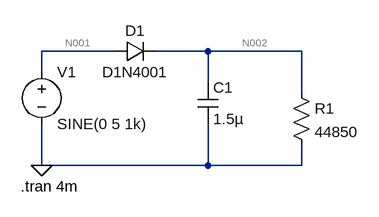
[diagram p0: schematic peak.asc]
peak.asc, the LTspice schematic file:
Version 4
SHEET 1 880 680
WIRE 128 144 16 144
WIRE 272 144 192 144
WIRE 416 144 272 144
WIRE 16 176 16 144
WIRE 272 192 272 144
WIRE 416 208 416 144
WIRE 16 320 16 256
WIRE 272 320 272 256
WIRE 272 320 16 320
WIRE 416 320 416 288
WIRE 416 320 272 320
FLAG 16 320 0
SYMBOL res 400 192 R0
SYMATTR InstName R1
SYMATTR Value 44850
SYMBOL diode 128 160 R270
WINDOW 0 32 32 VTop 2
WINDOW 3 0 32 VBottom 2
SYMATTR InstName D1
SYMATTR Value D1N4001
SYMBOL voltage 16 160 R0
WINDOW 123 0 0 Left 0
WINDOW 39 0 0 Left 0
SYMATTR InstName V1
SYMATTR Value SINE(0 5 1k)
SYMBOL cap 256 192 R0
SYMATTR InstName C1
SYMATTR Value 1.5µ
TEXT -16 352 Left 2 !.tran 4m

The netlist it stands for:
* peak.asc
R1 N002 0 44850
D1 N001 N002 D1N4001
V1 N001 0 SINE(0 5 1k)
C1 N002 0 1.5µ
.model D D
.lib standard.dio
.tran 4m
.backanno
.end

* Results of the author's LTspice run, read from the files saved beside the schematic
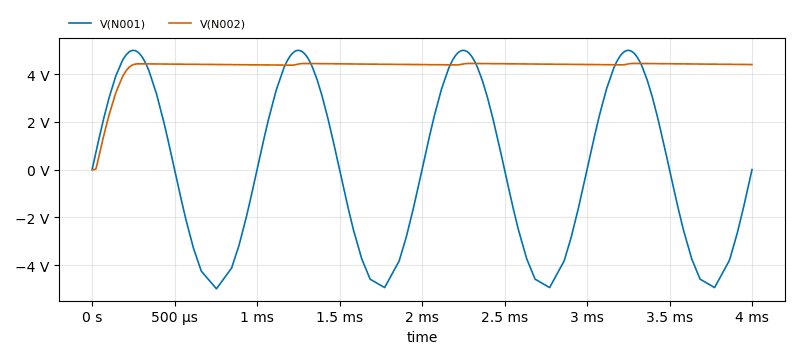
[diagram p1: Transient Analysis of peak.asc, plotted from the saved traces]
* Transient Analysis, 1 run:
*   V(N001): min -4.995 V, max 5 V, average 23.19 mV, rms 3.514 V, last 0 V
*   V(N002): min 0 V, max 4.452 V, average 4.299 V, rms 4.34 V, last 4.405 V